# EasyEDA Pro project ProProject_ESP32-CAN (1)_2024-07-23.epro, schematic pp8180
Create Date: 2024-03-05; Page Name: P1; Project Name: P1; Schematic Name: PP8180; Update Date: 2024-03-05; Company: EasyEDA.com; Drawn: EasyEDA; Page Size: A4; Part Number: JLCPCB-002; Reviewed: EasyEDA; Version: V0.1
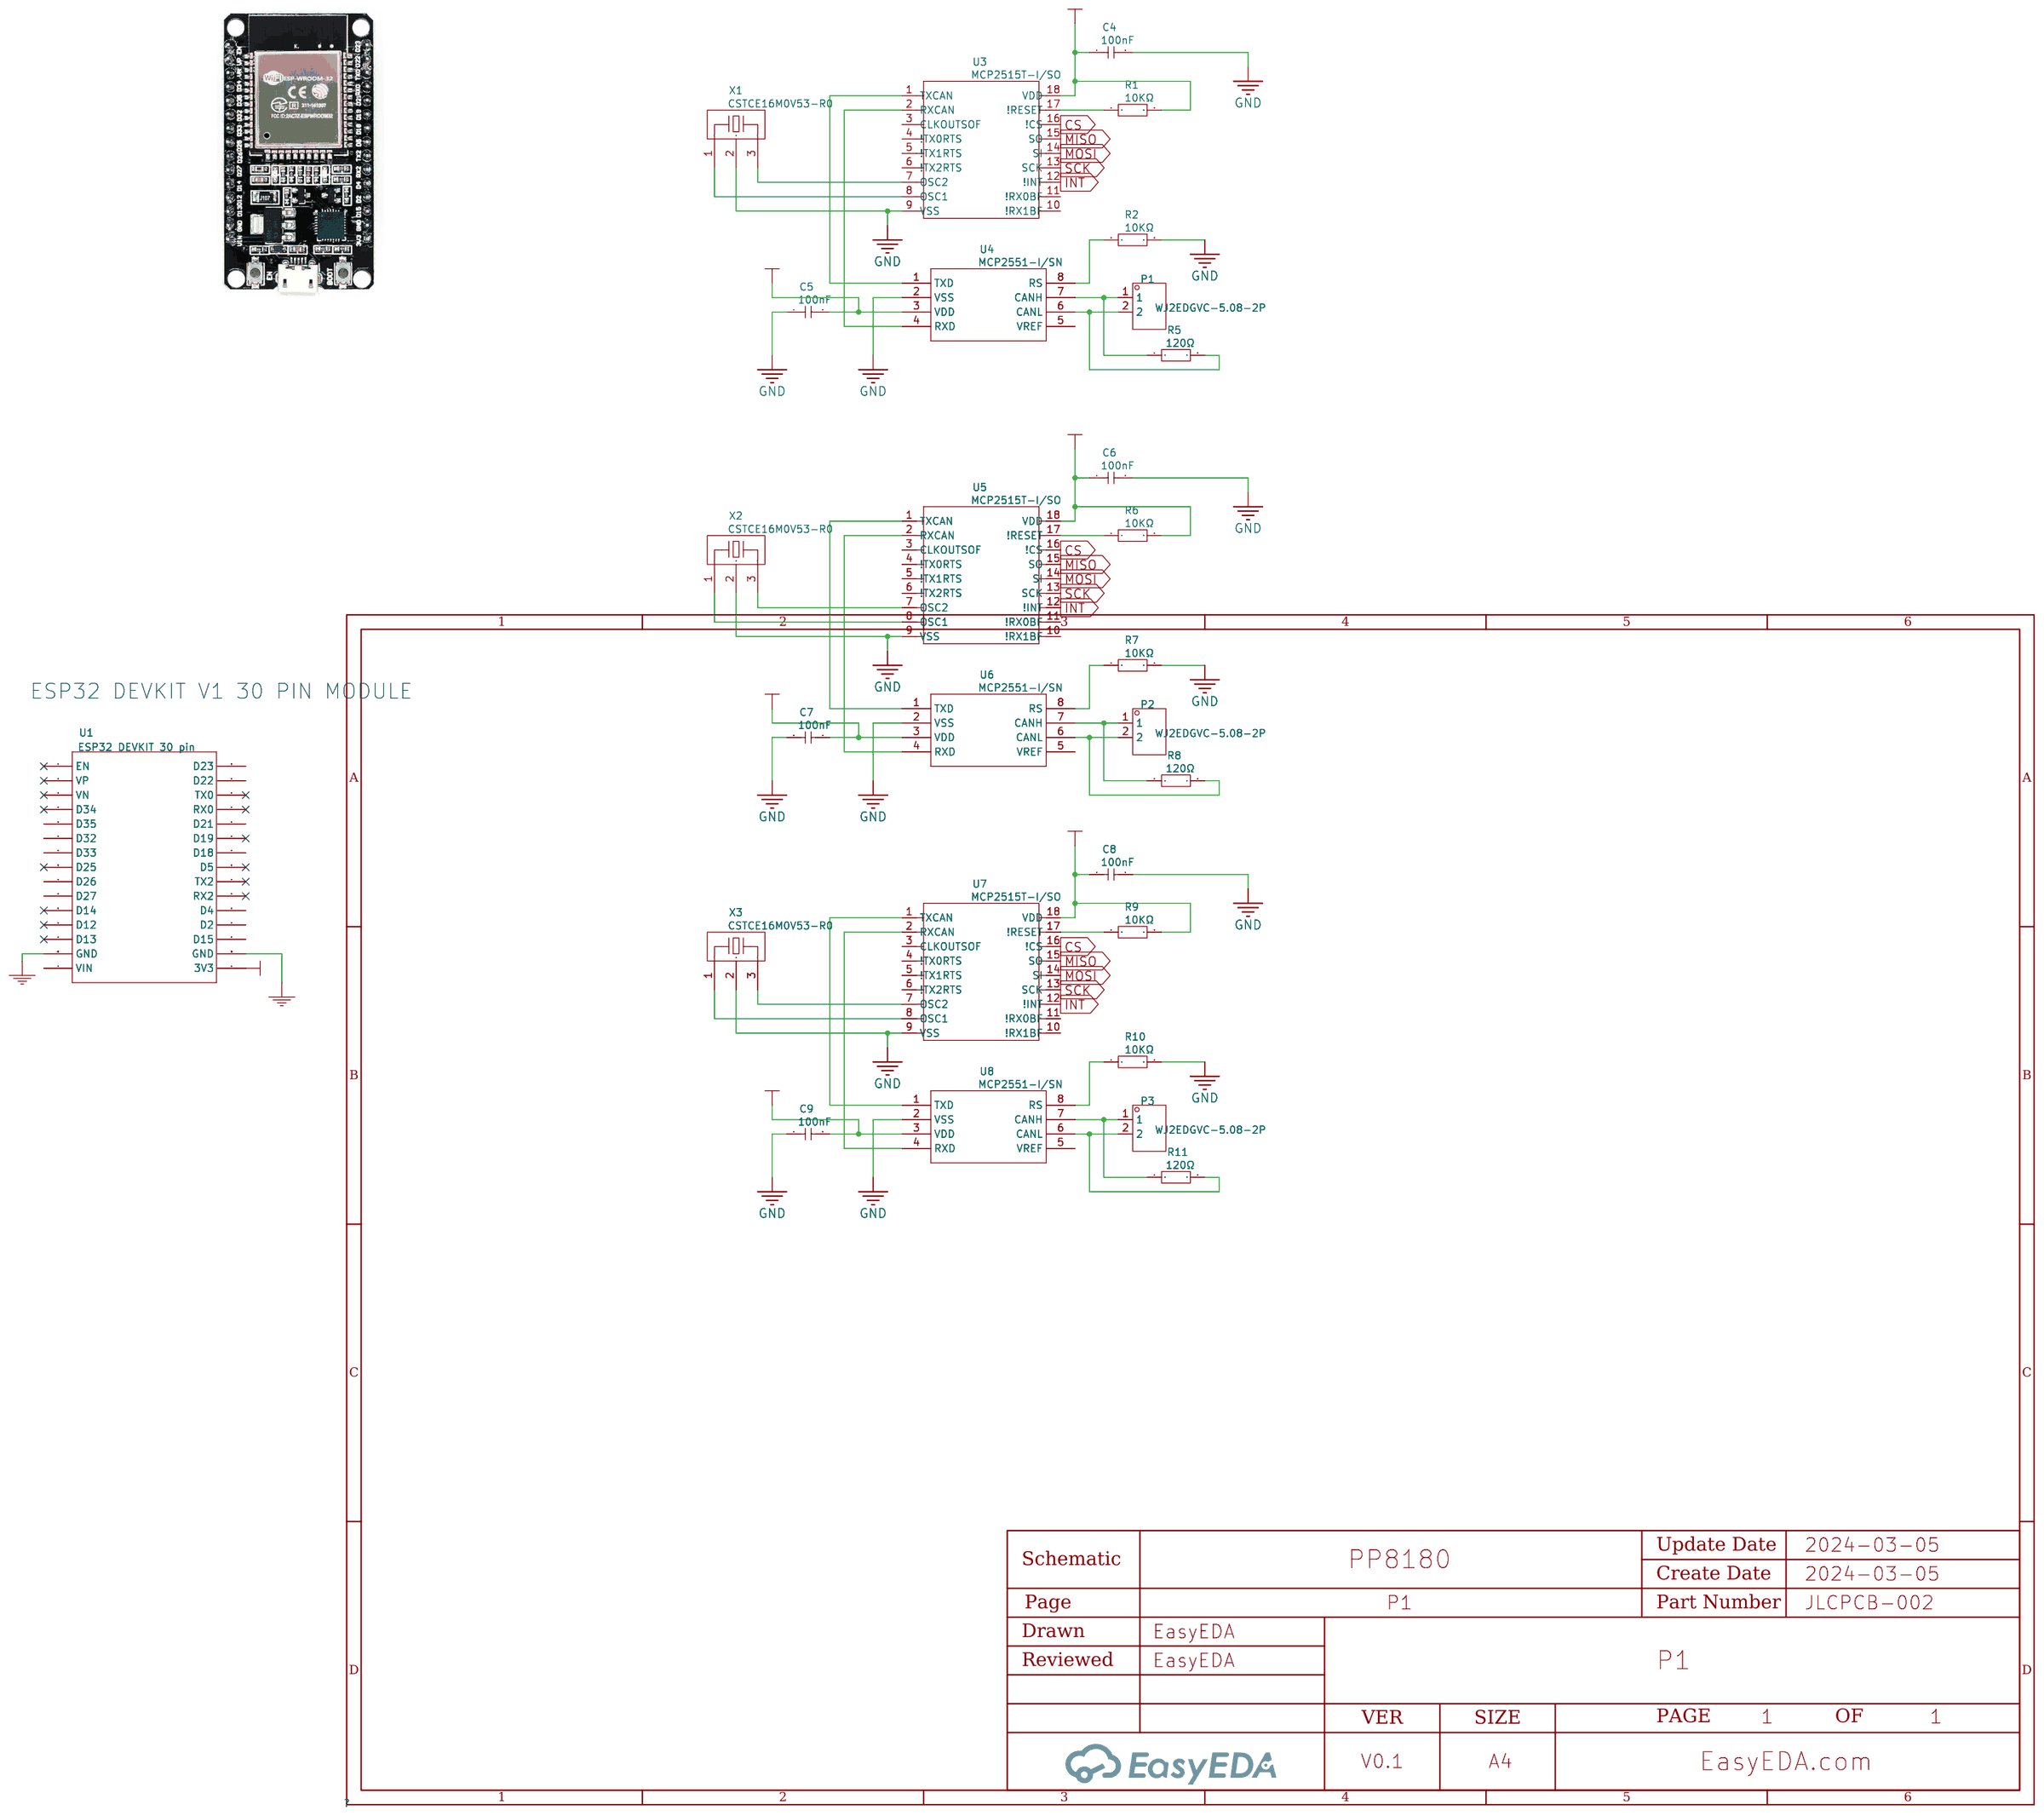
[diagram p4: schematic sheet]

## Parts
C4  100nF
C5  100nF
C6  100nF
C7  100nF
C8  100nF
C9  100nF
P1  WJ2EDGVC-5.08-2P
P2  WJ2EDGVC-5.08-2P
P3  WJ2EDGVC-5.08-2P
R1  10KΩ
R2  10KΩ
R5  120Ω
R6  10KΩ
R7  10KΩ
R8  120Ω
R9  10KΩ
R10  10KΩ
R11  120Ω
U1  ESP32 DEVKIT 30 pin
U3  MCP2515T-I/SO
U4  MCP2551-I/SN
U5  MCP2515T-I/SO
U6  MCP2551-I/SN
U7  MCP2515T-I/SO
U8  MCP2551-I/SN
X1  CSTCE16M0V53-R0
X2  CSTCE16M0V53-R0
X3  CSTCE16M0V53-R0

## Library data of the parts
C4-C9 = 100nF: SMD CAP Ceramic 100nF-50V-10%-X7R; Manufacturer Part: CC0603KRX7R9BB104
P1-P3 = WJ2EDGVC-5.08-2P: Supplier: LCSC; Manufacturer: ReliaPro; Supplier Part: C8445
R1 R2 R6 R7 R9 R10 = 10KΩ: Power: 1/10W; Tolerance: ±5%; Supplier: LCSC; Manufacturer: UniOhm; Manufacturer Part: 0603WAJ0103T5E; Supplier Part: C15401
R5 R8 R11 = 120Ω: Power: 1/10W; Tolerance: ±1%; Supplier: LCSC; Manufacturer: UniOhm; Manufacturer Part: 0603WAF1200T5E; Supplier Part: C22787
U1 = ESP32 DEVKIT 30 pin
U3 U5 U7 = MCP2515T-I/SO: SMD IC Interface;
U4 U6 U8 = MCP2551-I/SN: SMD IC Interface
X1-X3 = CSTCE16M0V53-R0: Supplier: LCSC; Manufacturer: muRata; Supplier Part: C32180

## Nets
+3V3: U1.3V3
+5V: C4.1 C5.2 C6.1 C7.2 C8.1 C9.2 R1.2 R6.2 R9.2 U3.18(VDD) U4.3(VDD) U5.18(VDD) U6.3(VDD) U7.18(VDD) U8.3(VDD)
GND: C4.2 C5.1 C6.2 C7.1 C8.2 C9.1 R2.2 R7.2 R10.2 U1.GND@1(GND) U1.GND@2(GND) U3.9(VSS) U4.2(VSS) U5.9(VSS) U6.2(VSS) U7.9(VSS) U8.2(VSS) X1.2 X2.2 X3.2
CS: U3.16(!CS) U5.16(!CS) U7.16(!CS)
INT: U3.12(!INT) U5.12(!INT) U7.12(!INT)
MISO: U3.15(SO) U5.15(SO) U7.15(SO)
MOSI: U3.14(SI) U5.14(SI) U7.14(SI)
SCK: U3.13(SCK) U5.13(SCK) U7.13(SCK)
Net-(P1-1): P1.1 R5.1 U4.7(CANH)
Net-(P1-2): P1.2 R5.2 U4.6(CANL)
Net-(P2-1): P2.1 R8.1 U6.7(CANH)
Net-(P2-2): P2.2 R8.2 U6.6(CANL)
Net-(P3-1): P3.1 R11.1 U8.7(CANH)
Net-(P3-2): P3.2 R11.2 U8.6(CANL)
Net-(R1-1): R1.1 U3.17(!RESET)
Net-(R2-1): R2.1 U4.8(RS)
Net-(R6-1): R6.1 U5.17(!RESET)
Net-(R7-1): R7.1 U6.8(RS)
Net-(R9-1): R9.1 U7.17(!RESET)
Net-(R10-1): R10.1 U8.8(RS)
Net-(U3-1): U3.1(TXCAN) U4.1(TXD)
Net-(U3-2): U3.2(RXCAN) U4.4(RXD)
Net-(U3-7): U3.7(OSC2) X1.3
Net-(U3-8): U3.8(OSC1) X1.1
Net-(U5-1): U5.1(TXCAN) U6.1(TXD)
Net-(U5-2): U5.2(RXCAN) U6.4(RXD)
Net-(U5-7): U5.7(OSC2) X2.3
Net-(U5-8): U5.8(OSC1) X2.1
Net-(U7-1): U7.1(TXCAN) U8.1(TXD)
Net-(U7-2): U7.2(RXCAN) U8.4(RXD)
Net-(U7-7): U7.7(OSC2) X3.3
Net-(U7-8): U7.8(OSC1) X3.1

Not connected (* = marked no-connect by the designer): U1 D2 D4 D5* D12* D13* D14* D15 D18 D19* D21 D22 D23 D25* D26 D27 D32 D33 D34* D35 EN* RX0* RX2* TX0* TX2* VIN VN* VP*; U3 3(CLKOUTSOF) 4(!TX0RTS) 5(!TX1RTS) 6(!TX2RTS) 10(!RX1BF) 11(!RX0BF); U4 5(VREF); U5 3(CLKOUTSOF) 4(!TX0RTS) 5(!TX1RTS) 6(!TX2RTS) 10(!RX1BF) 11(!RX0BF); U6 5(VREF); U7 3(CLKOUTSOF) 4(!TX0RTS) 5(!TX1RTS) 6(!TX2RTS) 10(!RX1BF) 11(!RX0BF); U8 5(VREF)

## Notes on the sheet
- ESP32 DEVKIT V1 30 PIN MODULE
